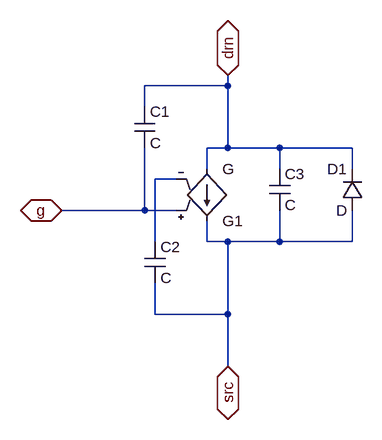
[diagram p0: schematic loss_model1.asc]
loss_model1.asc, the LTspice schematic file:
Version 4
SHEET 1 880 680
WIRE 208 -336 208 -352
WIRE 208 -336 80 -336
WIRE 80 -304 80 -336
WIRE 208 -240 208 -336
WIRE 208 -240 176 -240
WIRE 288 -240 208 -240
WIRE 400 -240 288 -240
WIRE 176 -208 176 -240
WIRE 288 -208 288 -240
WIRE 400 -208 400 -240
WIRE 128 -192 96 -192
WIRE 80 -144 80 -240
WIRE 80 -144 -48 -144
WIRE 128 -144 80 -144
WIRE 96 -96 96 -192
WIRE 176 -96 176 -128
WIRE 208 -96 176 -96
WIRE 288 -96 288 -144
WIRE 288 -96 208 -96
WIRE 400 -96 400 -144
WIRE 400 -96 288 -96
WIRE 96 16 96 -32
WIRE 208 16 208 -96
WIRE 208 16 96 16
WIRE 208 96 208 16
FLAG 208 -352 drn
IOPIN 208 -352 BiDir
FLAG 208 96 src
IOPIN 208 96 BiDir
FLAG -48 -144 g
IOPIN -48 -144 BiDir
SYMBOL g 176 -112 M180
SYMATTR InstName G1
SYMBOL cap 64 -304 R0
SYMATTR InstName C1
SYMBOL cap 80 -96 R0
SYMATTR InstName C2
SYMBOL cap 272 -208 R0
SYMATTR InstName C3
SYMBOL diode 416 -144 R180
WINDOW 0 24 64 Left 2
WINDOW 3 24 0 Left 2
SYMATTR InstName D1

The netlist it stands for:
* loss_model1.asc
G1 drn src g N001 G
C1 drn g C
C2 N001 src C
C3 drn src C
D1 src drn D
.model D D
.lib standard.dio
.backanno
.end